# Altium schematic sheet New Power (Becca).SchDoc
size A
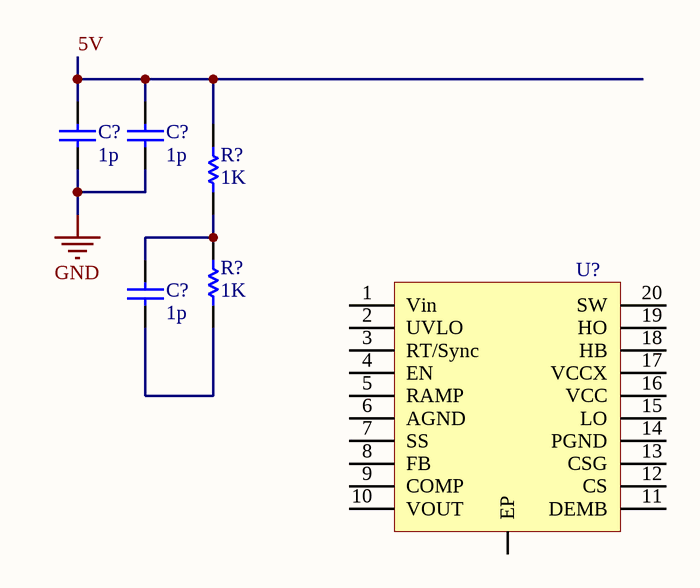
[diagram p0: New Power (Becca).SchDoc]

## Parts
(Parts that share a designator on the sheet are numbered #1, #2 ... from top to bottom, then left to right.)
C?#1  value 1p  (hidden comment: Capacitor)
C?#2  value 1p  (hidden comment: Capacitor)
C?#3  value 1p  (hidden comment: Capacitor)
R?#1  value 1K  (hidden comment: Resistor)
R?#2  value 1K  (hidden comment: Resistor)
U?  LM25116  [LM25116]  (value not drawn)

## Nets
GND: C?#1.1 C?#2.1
5V: C?#1.2 C?#2.2 R?#1.2
NetC?#3_1: C?#3.1 R?#2.1
NetC?#3_2: C?#3.2 R?#1.1 R?#2.2

Not connected (* = marked no-connect by the designer): U? 1(Vin) 2(UVLO) 3(RT/Sync) 4(EN) 5(RAMP) 6(AGND) 7(SS) 8(FB) 9(COMP) 10(VOUT) 11(DEMB) 12(CS) 13(CSG) 14(PGND) 15(LO) 16(VCC) 17(VCCX) 18(HB) 19(HO) 20(SW) 21(EP)

## Library data of the parts
C?#1-C?#3 = Capacitor: SimulationGenericComponent: True
R?#1 R?#2 = Resistor: TC1: 0; SimulationGenericComponent: True; TC2: 0
U? = LM25116: IC REG CTRLR BUCK 20TSSOP